# Altium schematic sheet COMS0001_Beacon.SchDoc: BLUEsat Beacon
size A3; Author: Daniel Jedrychowski; Engineer: D. JEDRYCHOWSKI; Organization: BLUEsat Project; Address1: Room 419; Address2: School of EE&T; Address3: UNSW, NSW 2052; Address4: Australia; DocumentNumber: COMS0001; SheetNumber: 1; SheetTotal: 1; Description: Morse code continuous wave beacon based on EPROM; Version: 1.1
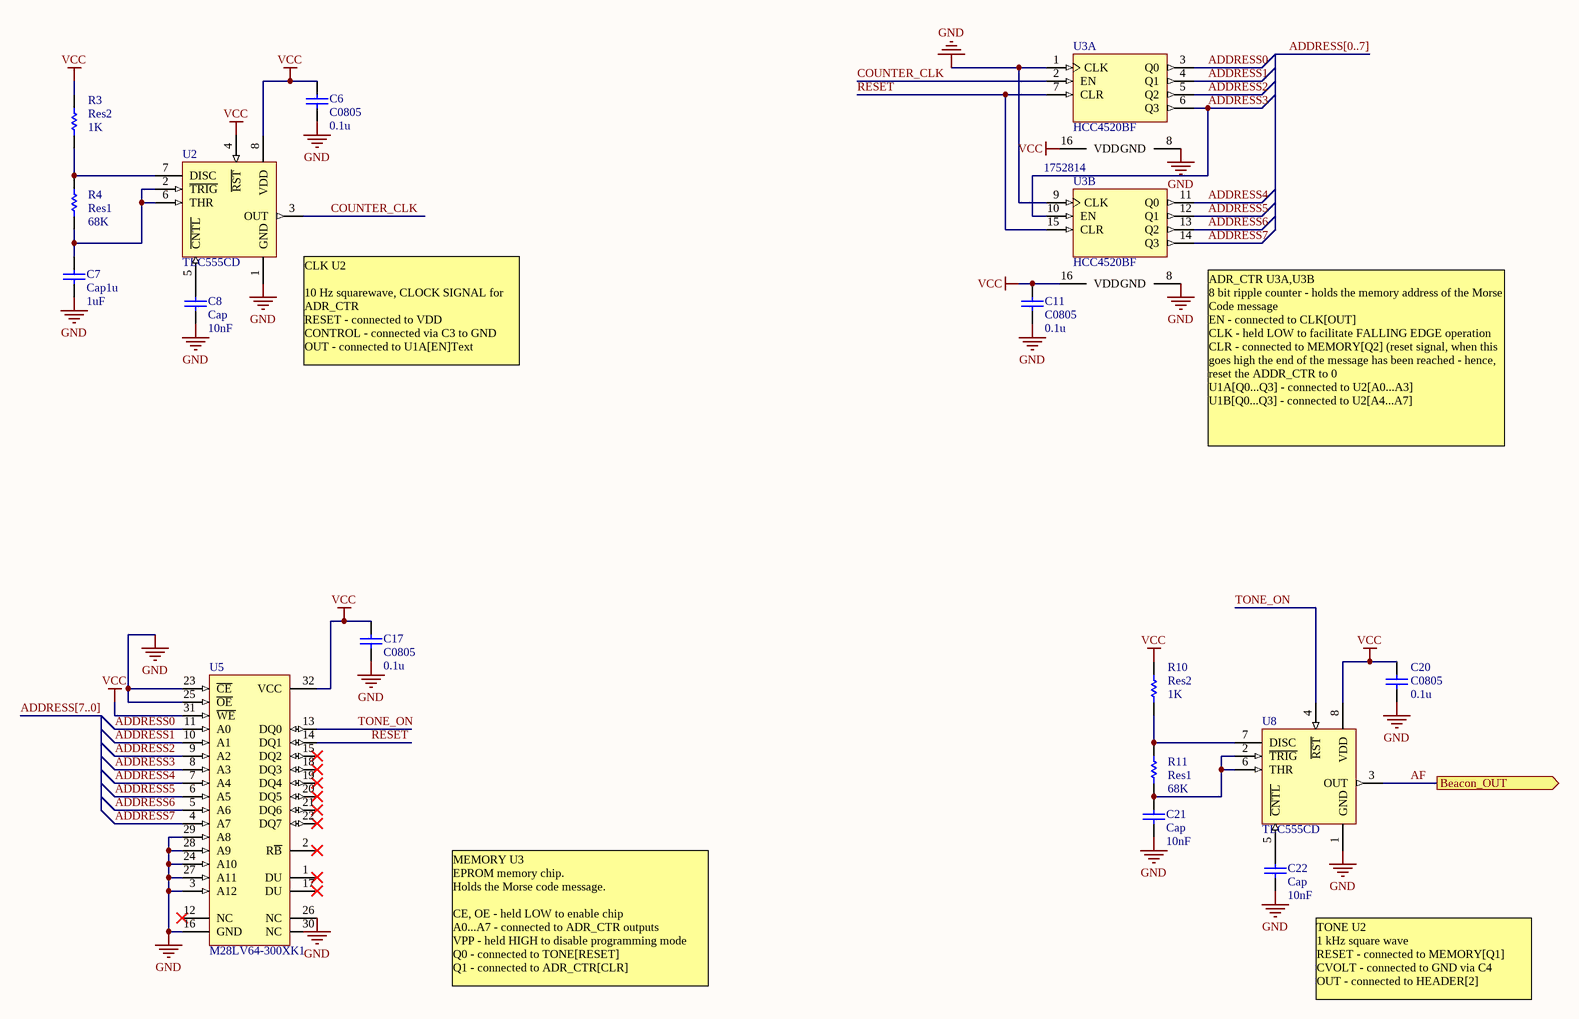
[diagram p0: COMS0001_Beacon.SchDoc]

## Parts
C6  C0805  value 0.1u  [CAPC2012M]
C7  Cap1u  value 1uF  [CAPC2012M]
C8  Cap  value 10nF  [CAPC2012M]
C11  C0805  value 0.1u  [CAPC2012M]
C17  C0805  value 0.1u  [CAPC2012M]
C20  C0805  value 0.1u  [CAPC2012M]
C21  Cap  value 10nF  [CAPC2012M]
C22  Cap  value 10nF  [CAPC2012M]
R3  Res2  value 1K  [RESC2012M]
R4  Res1  value 68K  [RESC2012M]
R10  Res2  value 1K  [RESC2012M]
R11  Res1  value 68K  [RESC2012M]
U2  TLC555CD  [D008_M]
U3  HCC4520BF  [SOIC16_M]  (parts A,B of 2)
U5  M28LV64-300XK1  [PLCC32]
U8  TLC555CD  [D008_M]

## Ports
Beacon_OUT (out)

## Nets
GND: C6.1 C7.1 C8.1 C11.1 C17.1 C20.1 C21.1 C22.1 U2.1(GND) U3.1(CLK) U3.8(GND) U3.9(CLK) U5.3(A12) U5.16(GND) U5.23(~{CE}) U5.24(A10) U5.25(~{OE}) U5.26(NC) U5.27(A11) U5.28(A9) U5.29(A8) U8.1(GND)
VCC: C6.2 C11.2 C17.2 C20.2 R3.2 R10.2 U2.4(~{RST}) U2.8(VDD) U3.16(VDD) U5.31(~{WE}) U5.32(VCC) U8.8(VDD)
ADDRESS0: U3.3(Q0) U5.11(A0)
ADDRESS1: U3.4(Q1) U5.10(A1)
ADDRESS2: U3.5(Q2) U5.9(A2)
ADDRESS3: U3.6(Q3) U3.10(EN) U5.8(A3)
ADDRESS4: U3.11(Q0) U5.7(A4)
ADDRESS5: U3.12(Q1) U5.6(A5)
ADDRESS6: U3.13(Q2) U5.5(A6)
ADDRESS7: U3.14(Q3) U5.4(A7)
AF: U8.3(OUT) ; port Beacon_OUT
COUNTER_CLK: U2.3(OUT) U3.2(EN)
RESET: U3.7(CLR) U3.15(CLR) U5.14(DQ1)
TONE_ON: U5.13(DQ0) U8.4(~{RST})
NetC7_2: C7.2 R4.1 U2.2(~{TRIG}) U2.6(THR)
NetC8_2: C8.2 U2.5(~{CNTL})
NetC21_2: C21.2 R11.1 U8.2(~{TRIG}) U8.6(THR)
NetC22_2: C22.2 U8.5(~{CNTL})
NetR3_1: R3.1 R4.2 U2.7(DISC)
NetR10_1: R10.1 R11.2 U8.7(DISC)

Not connected (* = marked no-connect by the designer): U5 1(DU)* 2(R~{B})* 12(NC)* 15(DQ2)* 17(DU)* 18(DQ3)* 19(DQ4)* 20(DQ5)* 21(DQ6)* 22(DQ7)* 30(NC)

## Buses and harness runs
bus ADDRESS[0..7]
bus ADDRESS[7..0]

## Notes on the sheet
- (near U2) CLK U2
  10 Hz squarewave, CLOCK SIGNAL for ADR_CTR
  RESET - connected to VDD
  CONTROL - connected via C3 to GND
  OUT - connected to U1A[EN]Text
- (near U3) ADR_CTR U3A,U3B
  8 bit ripple counter - holds the memory address of the Morse Code message
  EN - connected to CLK[OUT]
  CLK - held LOW to facilitate FALLING EDGE operation
  CLR - connected to MEMORY[Q2] (reset signal, when this goes high the end of the message has been reached - hence, reset the ADDR_CTR to 0
  U1A[Q0...Q3] - connected to U2[A0...A3]
  U1B[Q0...Q3] - connected to U2[A4...A7]
- MEMORY U3
  EPROM memory chip.
  Holds the Morse code message.
  CE, OE - held LOW to enable chip
  A0...A7 - connected to ADR_CTR outputs
  VPP - held HIGH to disable programming mode
  Q0 - connected to TONE[RESET]
  Q1 - connected to ADR_CTR[CLR]
- TONE U2
  1 kHz square wave
  RESET - connected to MEMORY[Q1]
  CVOLT - connected to GND via C4
  OUT - connected to HEADER[2]
- Title
- Description:
- Size:
- Author:
- Date:
- A3
- Time:
- Version
- Sheet:
- Drawing No.:
- of
- File:

## Library data of the parts
C6-C8 C11 C17 C20-C22 = Cap: Capacitor; Published: 8-Jun-2000; LatestRevisionDate: 17-Jul-2002; LatestRevisionNote: Re-released for DXP Platform.; PackageReference: RAD-0.3; Publisher: Altium Limited; Supplier 1: Farnell
  C6 C11 C17 C20: Supplier Part Number 1: 1650866
  C7: Supplier Part Number 1: 1637035
  C8 C21 C22: Supplier Part Number 1: 9406352
R3 R4 R10 R11 = Res1: Resistor; Published: 8-Jun-2000; LatestRevisionDate: 17-Jul-2002; LatestRevisionNote: Re-released for DXP Platform.; PackageReference: AXIAL-0.3; Publisher: Altium Limited; Supplier 1: Farnell
  R3 R10: Supplier Part Number 1: 1500663
  R4 R11: Supplier Part Number 1: 9234233
U2 U8 = TLC555CD: LinCMOS Timer; Published: 15-Apr-2002; LatestRevisionDate: 13-Apr-2006; LatestRevisionNote: IPC-7351 Footprint Added.; DatasheetVersion: Oct-1988; PackageVersion: Jan-1998; PackageReference: D008; Publisher: Altium Limited; PackageDescription: 8-Pin Small Outline Integrated Circuit 1.27 mm Pitch; Code_IPC: SOIC127P600-8; ComponentLink1Description: Manufacturer Link; ComponentLink1URL: http://www.ti.com/; ComponentLink2Description: Datasheet; ComponentLink2URL: http://www-s.ti.com/sc/ds/tlc555.pdf; Supplier 1: Farnell; Supplier Part Number 1: 1575195
  U2: Supplier 2: Farnell
  U8: Supplier 2: Mouser
U3 = HCC4520BF: Dual Binary Up-Counter; Published: 8-Jun-2000; LatestRevisionDate: 06-Jun-2005; LatestRevisionNote: Stylized 3D Model Added.; DatasheetVersion: Jun-1989; PackageVersion: Apr-1996; PackageReference: DIP16; Publisher: Altium Limited; PackageDescription: DIP; 16 Leads; Row Spacing 7.62 mm; Pitch 2.54 mm; ComponentLink1Description: Manufacturer Link; ComponentLink1URL: http://www.st.com/; Supplier 1: Farnell; Supplier Part Number 1: 1752814; Supplier 2: Farnell
U5 = M28LV64-300XK1: 64K (8K x 8) Low-Voltage Parallel EEPROM with Software Data Protection; Note: Do Not Use pins 1 and 17 (DU).; Published: 24-Aug-2001; LatestRevisionDate: 06-Jun-2005; LatestRevisionNote: Stylized 3D Model Added.; DatasheetVersion: May-1997; PackageVersion: Jun-1998; PackageReference: PLCC32; Publisher: Altium Limited; PackageDescription: Leaded Chip Carrier; 32 Leads; Body 11.5 x 14 mm; ComponentLink1Description: Manufacturer Link; ComponentLink1URL: http://www.st.com/; Code_JEDEC: MS-016-AE; Code_IPC: PLCC/R-32